# Altium schematic sheet Sheet1.SchDoc
size A4
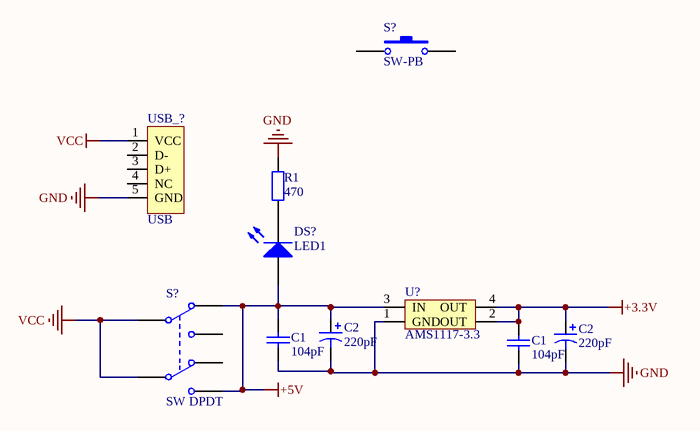
[diagram p0: Sheet1.SchDoc]

## Parts
(Parts that share a designator on the sheet are numbered #1, #2 ... from top to bottom, then left to right.)
C1#1  value 104pF  [RAD-0.3]  (hidden comment: Cap)
C1#2  value 104pF  [RAD-0.3]  (hidden comment: Cap)
C2#1  value 220pF  [C0805]  (hidden comment: Cap Pol3)
C2#2  value 220pF  [C0805]  (hidden comment: Cap Pol3)
DS?  LED1  [SMDLED]
R1  value 470  [AXIAL-0.4]  (hidden comment: Res2)
S?#1  SW-PB  [SPST-2]
S?#2  SW DPDT  [SOT23-6_N]
U?  AMS1117-3.3  [AMS1117]
USB_?  USB  [USB/SM0.8-6H5]

## Nets
+3.3V: C1#2.1 C2#2.1 U?.2(OUT) U?.4(OUT)
+5V: C1#1.1 C2#1.1 DS?.1(A) S?#2.2(NC1) S?#2.6(NO2) U?.3(IN)
GND: C1#1.2 C1#2.2 C2#1.2 C2#2.2 R1.2 U?.1(GND) USB_?.5(GND)
VCC: S?#2.1(COMMON1) S?#2.5(COMMON2) USB_?.1(VCC)
NetDS?_2: DS?.2(K) R1.1

Not connected (* = marked no-connect by the designer): S?#1 1 2; S?#2 3(NO1) 4(NC2); USB_? 2(D-) 3(D+) 4(NC)

## Library data of the parts
C1#1 C1#2 = Cap: Capacitor; Published: 8-Jun-2000; LatestRevisionDate: 17-Jul-2002; LatestRevisionNote: Re-released for DXP Platform.; PackageReference: RAD-0.3; Publisher: Altium Limited; PackageDescription: Radial Cap, Thru-Hole; 2 Leads; 0.3 in Pin Spacing
C2#1 C2#2 = Cap Pol3: Polarized Capacitor (Surface Mount); Published: 8-Jun-2000; LatestRevisionDate: 29-May-2009; LatestRevisionNote: IPC-7351 Footprint Added.; PackageReference: C0805; Publisher: Altium Limited; PackageDescription: Chip Capacitor
DS? = LED2: Typical RED, GREEN, YELLOW, AMBER GaAs LED; Published: 8-Jun-2000; LatestRevisionDate: 17-Jul-2002; LatestRevisionNote: Re-released for DXP Platform.; PackageDocument: Feb-2002; PackageReference: 3.2X1.6X1.1; Publisher: Altium Limited
R1 = Res2: Resistor; Published: 8-Jun-2000; LatestRevisionDate: 17-Jul-2002; LatestRevisionNote: Re-released for DXP Platform.; PackageReference: AXIAL-0.4; Publisher: Altium Limited; PackageDescription: Axial Device, Thru-Hole; 2 Leads; 0.4 in Pin Spacing
S?#1 = SW-PB: Switch; Published: 24-Mar-1999; LatestRevisionDate: 17-Jul-2002; LatestRevisionNote: Re-released for DXP Platform.; PackageReference: SPST-2; Publisher: Altium Limited; PackageDescription: Switch; 2 Leads
S?#2 = SW DPDT: Switch; Published: 24-Mar-1999; LatestRevisionDate: 29-May-2009; LatestRevisionNote: IPC-7351 Footprint Added.; PackageVersion: Mar-2001; PackageReference: SOT23-6; Publisher: Altium Limited; PackageDescription: 6-Pin SOT-23 Package 0.95 mm Pitch, 2.7 mm Lead Span; Code_JEITA: SC-74; Code_IPC: SOT26A-6
U? = AMS1117
USB_? = USB5